# EAGLE design anemometer_v4 (EAGLE 9.5.2)
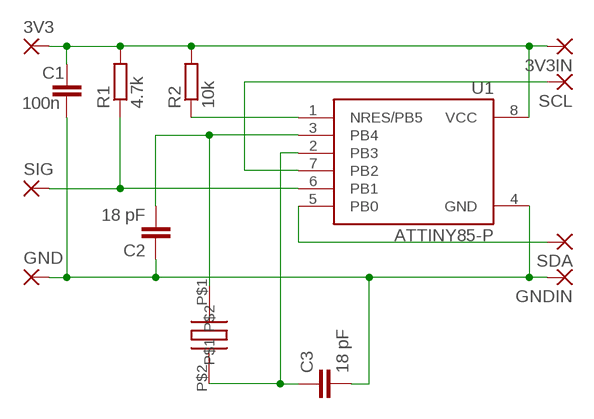
[diagram p0: schematic, sheet 1]

## Parts
3V3  1,6/0,9  [1,6/0,9]
3V3IN  1,6/0,9  [1,6/0,9]
C1  100n  C-EUC1206  [C1206]
C2  18 pF  C-EUC0805  [C0805]
C3  18 pF  C-EUC0805  [C0805]
GND  1,6/0,9  [1,6/0,9]
GNDIN  1,6/0,9  [1,6/0,9]
R1  4.7k  R-EU_R1206  [R1206]
R2  10k  R-EU_R0805  [R0805]
SCL  1,6/0,9  [1,6/0,9]
SDA  1,6/0,9  [1,6/0,9]
SIG  1,6/0,9  [1,6/0,9]
U1  ATTINY85-P  [PDIP08_300MIL]
U$1  QCL16.0000F18B23B  [QCL16.0000F18B23B]

## Nets
3V3: 3V3.1(P) 3V3IN.1(P) C1.1 R1.2 R2.2 U1.8(VCC)
GND: C1.2 C2.1 C3.2 GND.1(P) GNDIN.1(P) U1.4(GND)
N$2: SDA.1(P) U1.5(PB0)
N$3: SCL.1(P) U1.7(PB2)
N$4: R1.1 SIG.1(P) U1.6(PB1)
N$6: C2.2 U1.3(PB4) U$1.P$1
N$7: C3.1 U1.2(PB3) U$1.P$2
N$8: R2.1 U1.1(NRES/PB5)

## Library data of the parts
3V3 3V3IN GND GNDIN SCL SDA SIG = wirepad:1,6/0,9: THROUGH-HOLE PAD
C1-C3 = rcl:C-EU: CAPACITOR, European symbol; SPICEPREFIX: C
R1 R2 = rcl:R-EU_: RESISTOR, European symbol; SPICEPREFIX: R
U1 = _hhn_attiny25_45_85:ATTINY85*: ATMEL ATtiny 85 Packages: P = PDIP 08 30mil S = SOIC 08 EIAJ 208mil Technologies Note: for complete ordering code (temp. range, finish, tape&reel etc.) see www.atmel.com • Supply Voltage: V = (1.8…5.5)V | [blank] = (2.7…5.5)V • Speed: 10 = 10 MHz | 20 = 20 MHz Author: Dipl.-Ing. FH Rainer Bayer HHN Hochschule Heilbronn (Heilbronn University), rainer.bayer@hs-heilbronn.de Ingenieurbüro ing-rb, mail@ing-rb.de
U$1 = Crystal:QCL16.0000F18B23B: 16 MHz Crystal

## Board
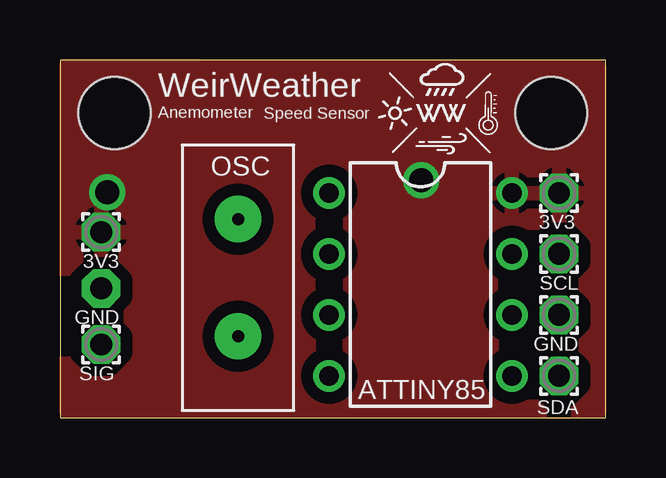
[diagram p1: board, top side]
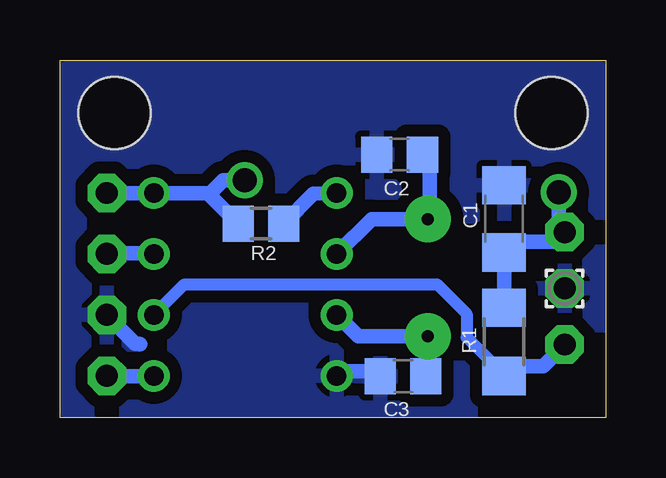
[diagram p2: board, bottom side, seen from below]

Size 22.74 x 14.91 mm. Coordinates in mm from the lower left corner, seen from the top.
Outline: 0,0 22.74,0 22.74,14.91 0,14.91 0,0
Copper layers (1*16): Top 0.035mm / dielectric 1.5mm / Bottom 0.035mm
Design rules "default *": minimum track width 24mil, minimum drill 1mm, track to track 20mil, track to pad 12mil, pad to pad 10mil, via to via 10mil, smd to smd 10mil, copper to edge 0mil, drill to drill 3mil, minimum pad ring 10mil, minimum via ring 8mil, stop-mask expansion 4mil, vias tented up to drill 0mil, thermal gap 10mil
Holes 3 mm at 20.47,12.7 2.27,12.7

### Footprints (pad centres in the part's own frame; a part is rotated, then mirrored left to right if it is on the bottom)
1,6/0,9 = drill 0.914 pad 1.6 octagon: 1 0,0
C1206 = smd 1.6 x 1.8: 1 -1.4,0; 2 1.4,0
C0805 = smd 1.3 x 1.5: 1 -0.95,0; 2 0.95,0
R1206 = smd 1.6 x 1.803: 1 -1.422,0; 2 1.422,0
R0805 = smd 1.3 x 1.5: 1 -0.95,0; 2 0.95,0
PDIP08_300MIL = drill 0.813: 1 -3.81,-3.81; 2 -1.27,-3.81; 3 1.27,-3.81; 4 3.81,-3.81; 5 3.81,3.81; 6 1.27,3.81; 7 -1.27,3.81; 8 -3.81,3.81
QCL16.0000F18B23B = drill 0.5 pad 1.93: P$1 -2.44,0; P$2 2.44,0

### Placement (x,y rotation side)
3V3  1.71,7.74 0 top
3V3IN  20.79,9.37 0 top
C1  4.24,8.3 90 bottom
C2  8.45,1.74 0 bottom
C3  8.59,10.97 180 bottom
GND  1.71,5.4 0 bottom
GNDIN  20.79,4.29 0 top
R1  4.24,3.17 90 bottom
R2  14.37,8.1 180 bottom
SCL  20.79,6.83 0 top
SDA  20.79,1.75 0 top
SIG  1.71,3.06 0 top
U1  15.02,5.56 270 top
U$1  7.42,5.84 90 top

### Tracks (layer width: path | path; a pad name or v marks a point on that pad's centre or on a via)
3V3  (via drill 1)
  Bottom 0.61: R2.2 16.59,9.37 | 3V3IN.1 U1.8 16.59,9.37 | v15.04,9.9 15.94,9.9 16.47,9.37 16.59,9.37 | v1.97,9.4 1.97,7.74 3V3.1 2.11,7.34 3.8,7.34 C1.1 | C1.1 3.78,7.09 | C1.1 4.24,5.1 3.99,4.84 R1.2
  pour Top: 0.27,14.66 22.47,14.6 22.47,0.3 0.27,0.3
GND
  Bottom 0.61: GNDIN.1 19.6,3.1 19.44,3.1 19.4,3.07 | U1.4 11.03,1.94 9.7,1.94 9.5,1.74 C2.1
  pour Bottom: 0.27,14.6 22.47,14.6 22.47,0.3 0.27,0.3
N$2
  Bottom 0.61: U1.5 18.86,1.73 20.77,1.73 SDA.1
N$3
  Bottom 0.61: U1.7 18.9,6.86 20.79,6.86 SCL.1
N$4
  Bottom 0.508: 4.24,2.05 R1.1 4.24,1.8 5.8,3.36 5.8,4.33 7.03,5.56 17.56,5.56 U1.6
  Bottom 0.61: SIG.1 2.61,2.16 3.83,2.16 R1.1
N$6
  Bottom 0.61: U1.3 10.32,3.4 U$1.P$1 7.42,1.82 C2.2
N$7
  Bottom 0.61: U1.2 9.76,8.28 U$1.P$2 7.34,8.36 7.34,10.67 C3.1
N$8
  Bottom 0.61: U1.1 11.48,9.37 12.18,9.34 R2.1

### Text on the board
tNames: WeirWeather | Anemometer | Speed Sensor | OSC | 3V3 | 3V3 | SCL | GND | GND | SIG | ATTINY85 | SDA
bNames: C2 | C1 | R2 | R1 | C3